# EAGLE design Schematic (EAGLE 8.6.3)
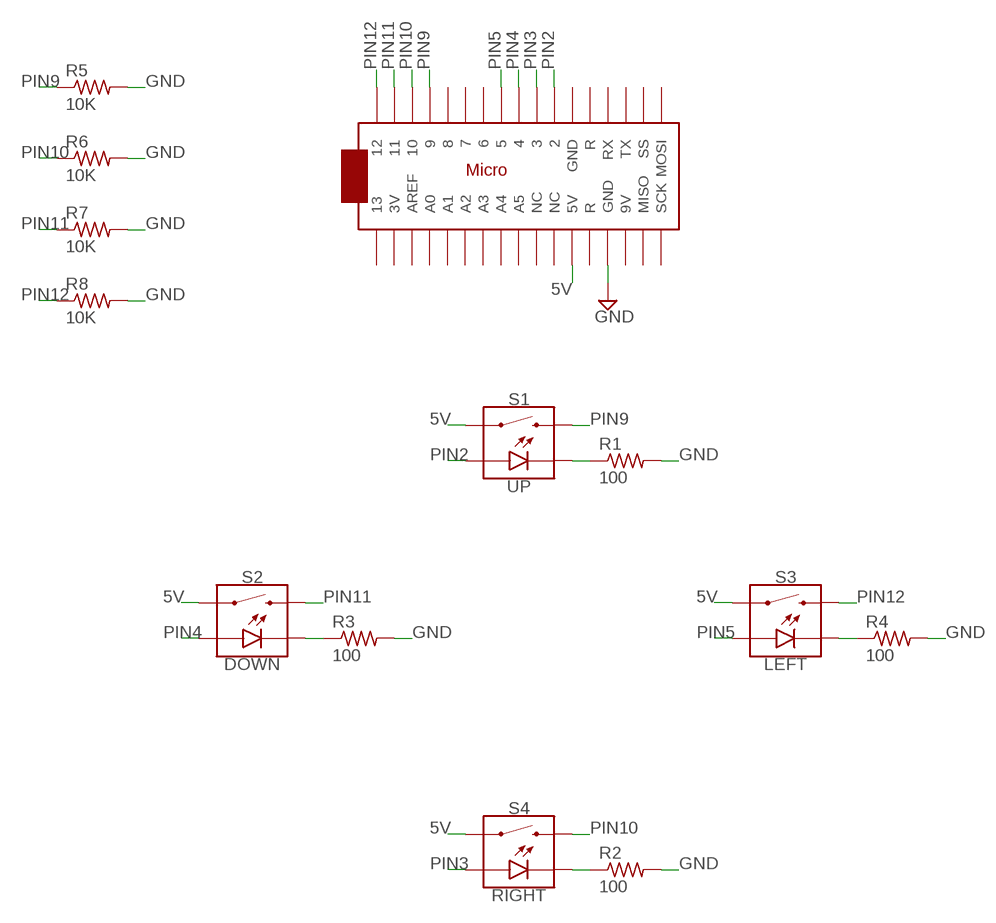
[diagram p0: schematic, sheet 1]

## Parts
R1  100  R-US_0207/7  [0207/7]
R2  100  R-US_0207/7  [0207/7]
R3  100  R-US_0207/7  [0207/7]
R4  100  R-US_0207/7  [0207/7]
R5  10K  R-US_0207/7  [0207/7]
R6  10K  R-US_0207/7  [0207/7]
R7  10K  R-US_0207/7  [0207/7]
R8  10K  R-US_0207/7  [0207/7]
S1  UP  MOMENTARY-SWITCH-SPST-LED-PTH-12MM-KIT  [TACTILE_SWITCH_LED_PTH_12MM_KIT]
S2  DOWN  MOMENTARY-SWITCH-SPST-LED-PTH-12MM-KIT  [TACTILE_SWITCH_LED_PTH_12MM_KIT]
S3  LEFT  MOMENTARY-SWITCH-SPST-LED-PTH-12MM-KIT  [TACTILE_SWITCH_LED_PTH_12MM_KIT]
S4  RIGHT  MOMENTARY-SWITCH-SPST-LED-PTH-12MM-KIT  [TACTILE_SWITCH_LED_PTH_12MM_KIT]
U$1  ARDUINOMICRO  [ARDUINOMICRO]

## Nets
5V: S1.4 S2.4 S3.4 S4.4 U$1.P$23(5V)
GND: R1.2 R2.2 R3.2 R4.2 R5.2 R6.2 R7.2 R8.2 U$1.P$12(GND)
N$5: R1.1 S1.C
N$6: R3.1 S2.C
N$7: R2.1 S4.C
N$8: R4.1 S3.C
PIN2: S1.A U$1.P$11
PIN3: S4.A U$1.P$10
PIN4: S2.A U$1.P$9
PIN5: S3.A U$1.P$8
PIN9: R5.1 S1.2 U$1.P$4
PIN10: R6.1 S4.2 U$1.P$3
PIN11: R7.1 S2.2 U$1.P$2
PIN12: R8.1 S3.2 U$1.P$1
Unconnected: U$1.P$5 U$1.P$6 U$1.P$7 U$1.P$13(R) U$1.P$14(RX) U$1.P$15(TX) U$1.P$16(SS) U$1.P$17(MOSI) U$1.P$18(SCK) U$1.P$19(MISO) U$1.P$20(9V) U$1.P$21(GND) U$1.P$22(R) U$1.P$24(NC) U$1.P$25(NC) U$1.P$26(A5) U$1.P$27(A4) U$1.P$28(A3) U$1.P$29(A2) U$1.P$30(A1) U$1.P$31(A0) U$1.P$32(AREF) U$1.P$33(3V) U$1.P$34

## Library data of the parts
R1-R8 = adafruit:R-US_: RESISTOR, American symbol
S1-S4 = SparkFun-Switches:MOMENTARY-SWITCH-SPST-LED: Momentary Switch (Pushbutton) - SPST - w/ LED Normally-open (NO) SPST momentary switches (buttons, pushbuttons), with a built-in LED. Variants PTH-CHERRY - Cherry MX Switch Cherry MX Keyswitches are top-of-the-line mechanical keyboard switches. They’re satisfyingly “clicky”, reliable up to tens-of-millions of key presses, and a standard in gaming and programming keyboards across the globe. This ‘blue’ version Cherry MX Switch is favored by most due to its secondary internal actuator making it less likely to “double-tap.” If you are looking for a noticeably audible and high-quality key switch, this is the perfect option for you! Cherry MX Switch <https://www.sparkfun.com/products/13834> (COM-13834) Cherry MX Switch Breakout <https://www.sparkfun.com/products/13773> (BOB-13773) PTH-12MM and PTH-12MM-KIT - 12mm Illuminated LED KIT variant is for soldering kits. There is no tStop (covering up the top side of the pads with mask). This helps the beginner see which side they should be soldering too. LED Tactile Button Breakout <https://www.sparkfun.com/products/10467> (BOB-10467) LED Tactile Button - Red <https://www.sparkfun.com/products/10442> (COM-10442) LED Tactile Button - Blue <https://www.sparkfun.com/products/10443> (COM-10443) LED Tactile Button - Green <https://www.sparkfun.com/products/10440> (COM-10440) LED Tactile Button - Orange <https://www.sparkfun.com/products/10441> (COM-10441) LED Tactile Button - White <https://www.sparkfun.com/products/10439> (COM-10439); PROD_ID: SWCH-11758; SF_SKU: COM-10442
U$1 = adafruit:ARDUINOMICRO

## Board
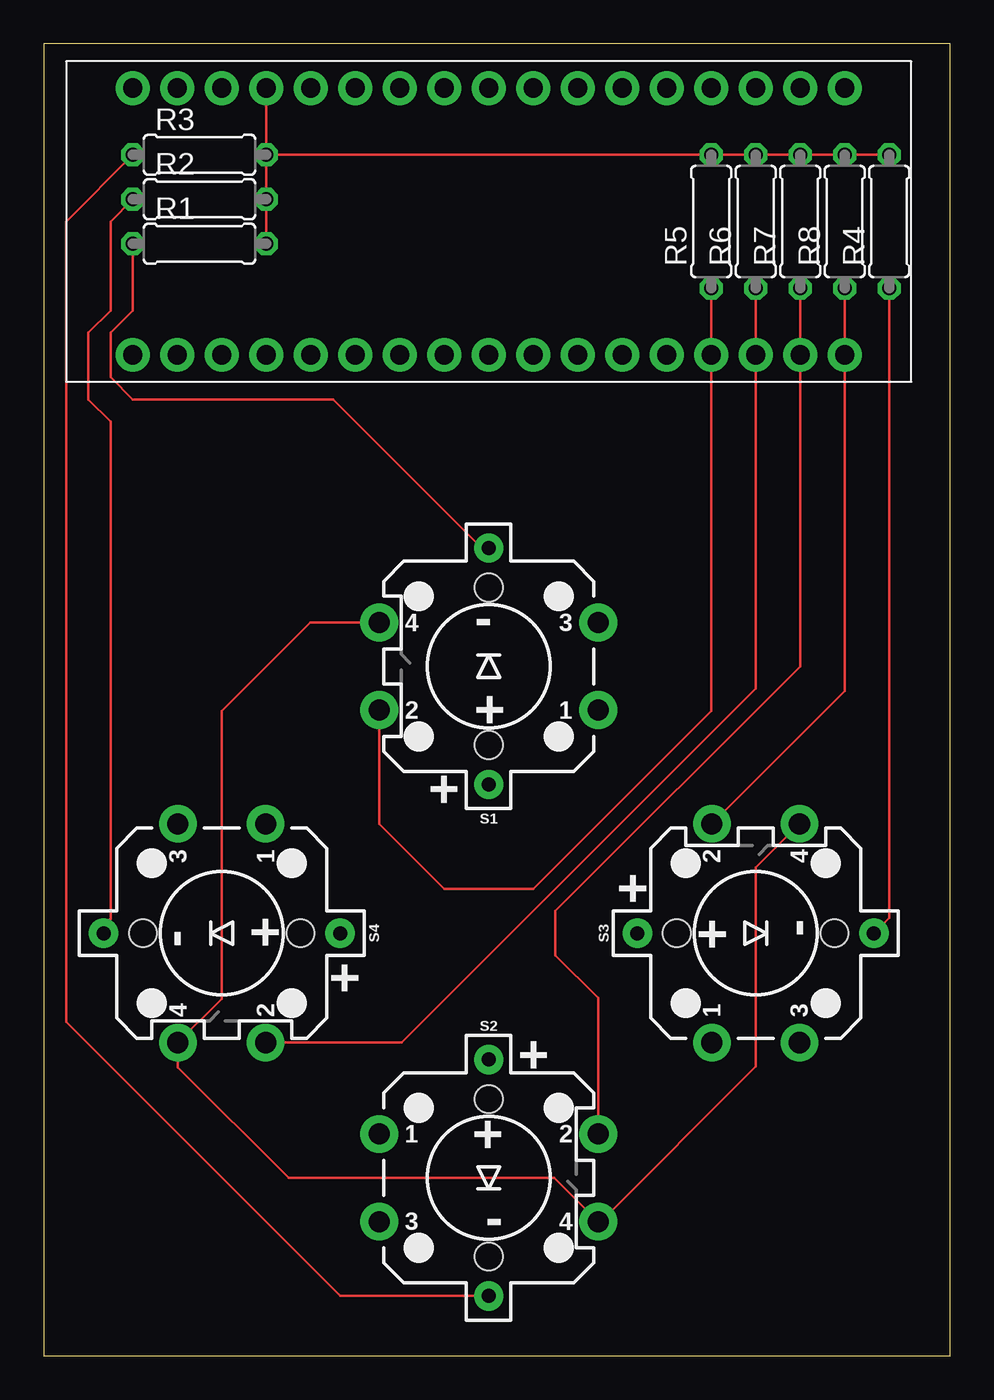
[diagram p1: board, top side]
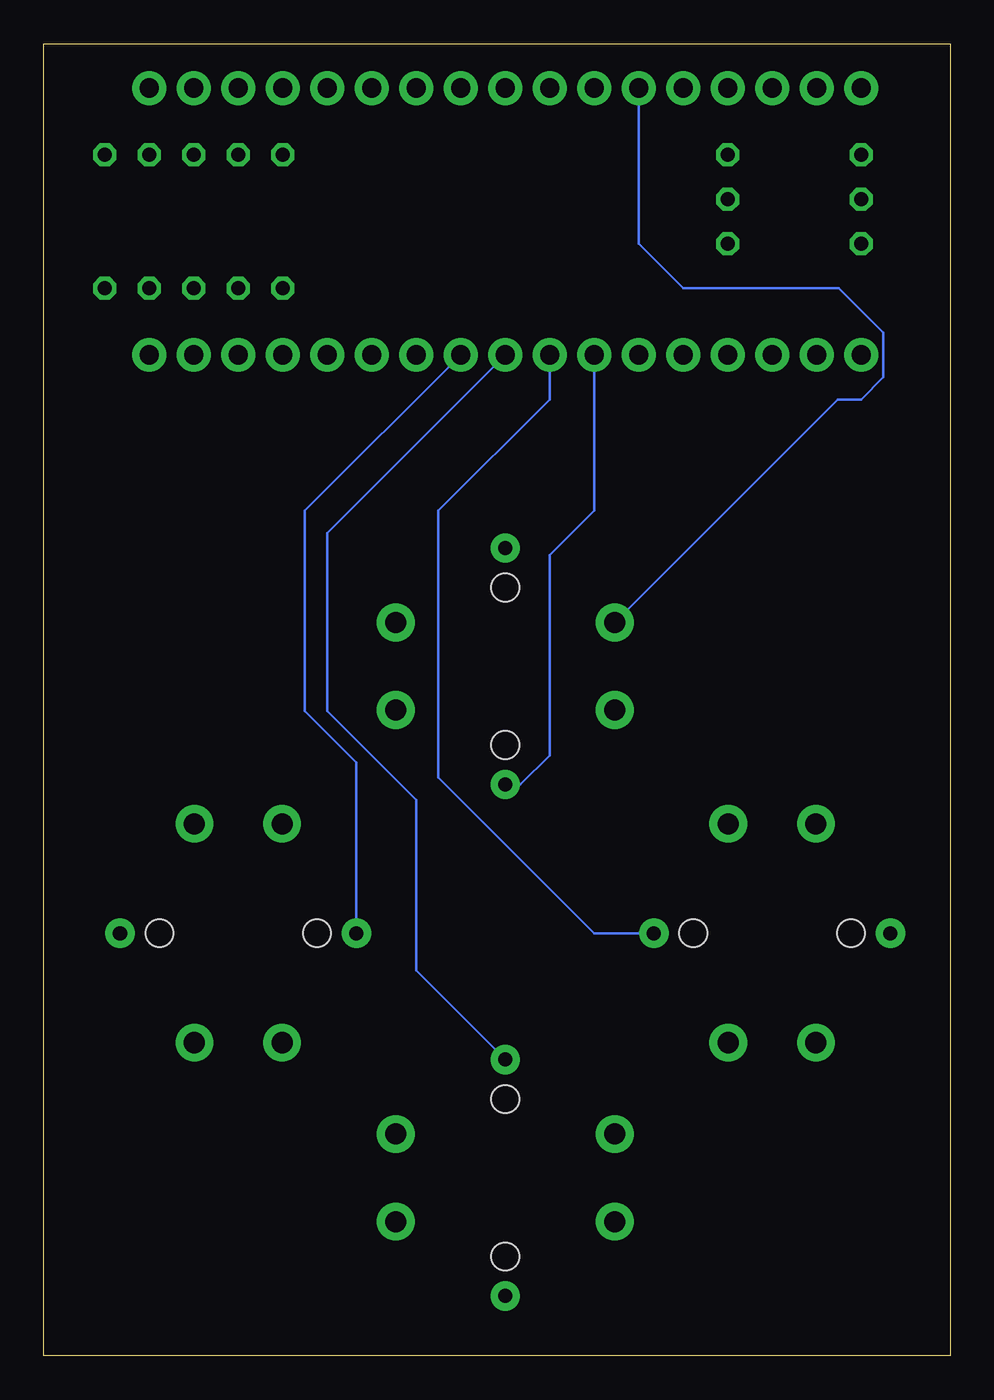
[diagram p2: board, bottom side, seen from below]

Size 51.74 x 74.92 mm. Coordinates in mm from the lower left corner, seen from the top.
Outline: 0,0 51.74,0 51.74,74.92 0,74.92 0,0
Copper layers (1*16): Top 0.035mm / dielectric 1.5mm / Bottom 0.035mm
Design rules "default": minimum track width 6mil, minimum drill 0.35mm, track to track 6mil, track to pad 6mil, pad to pad 6mil, via to via 6mil, smd to smd 6mil, copper to edge 40mil, drill to drill 6mil, minimum pad ring 10mil, minimum via ring 8mil, stop-mask expansion 4mil, vias tented up to drill 0mil, thermal gap 10mil

### Footprints (pad centres in the part's own frame; a part is rotated, then mirrored left to right if it is on the bottom)
0207/7 = drill 0.813 octagon: 1 -3.81,0; 2 3.81,0
TACTILE_SWITCH_LED_PTH_12MM_KIT = drill 1.2 pad 2.159: 1 -6.25,2.5; 2 6.25,2.5; 3 -6.25,-2.5; 4 6.25,-2.5 | drill 0.8 pad 1.676: A 0,6.75; C 0,-6.75 | hole 1.6: 0,4.5; 0,-4.5
ARDUINOMICRO = drill 1.1 pad 1.93: P$1 -20.32,7.62; P$2 -17.78,7.62; P$3 -15.24,7.62; P$4 -12.7,7.62; P$5 -10.16,7.62; P$6 -7.62,7.62; P$7 -5.08,7.62; P$8 -2.54,7.62; P$9 0,7.62; P$10 2.54,7.62; P$11 5.08,7.62; P$12 12.7,-7.62; P$13 10.16,-7.62; P$14 12.7,7.62; P$15 15.24,7.62; P$16 17.78,7.62; P$17 20.32,7.62; P$18 20.32,-7.62; P$19 17.78,-7.62; P$20 15.24,-7.62; P$21 7.62,7.62; P$22 10.16,7.62; P$23 7.62,-7.62; P$24 5.08,-7.62; P$25 2.54,-7.62; P$26 0,-7.62; P$27 -2.54,-7.62; P$28 -5.08,-7.62; P$29 -7.62,-7.62; P$30 -10.16,-7.62; P$31 -12.7,-7.62; P$32 -15.24,-7.62; P$33 -17.78,-7.62; P$34 -20.32,-7.62

### Placement (x,y rotation side)
R1  8.89,63.5 0 top
R2  8.89,66.04 0 top
R3  8.89,68.58 0 top
R4  48.26,64.77 90 top
R5  38.1,64.77 90 top
R6  40.64,64.77 90 top
R7  43.18,64.77 90 top
R8  45.72,64.77 90 top
S1  25.4,39.37 180 top
S2  25.4,10.16 0 top
S3  40.64,24.13 90 top
S4  10.16,24.13 270 top
U$1  25.4,64.77 180 top

### Tracks (layer width: path | path; a pad name or v marks a point on that pad's centre or on a via)
5V
  Top 0.152: S1.4 15.2,41.87 10.16,36.83 10.16,20.38 S4.4 7.66,16.47 13.97,10.16 29.15,10.16 S2.4 31.79,7.66 40.64,16.51 40.64,27.88 S3.4
  Bottom 0.152: S1.4 6.41,54.61 5.08,54.61 3.81,55.88 3.81,58.42 6.35,60.96 15.24,60.96 17.78,63.5 U$1.P$23
GND
  Top 0.152: R1.2 R2.2 R3.2 | R3.2 U$1.P$12 | R3.2 R5.2 R6.2 R7.2 R8.2 R4.2
N$5
  Top 0.152: R1.1 5.08,59.69 3.81,58.42 3.81,55.88 5.08,54.61 16.51,54.61 25,46.12 S1.C
N$6
  Top 0.152: R3.1 1.27,64.77 1.27,19.05 16.91,3.41 S2.C
N$7
  Top 0.152: R2.1 3.81,64.77 3.81,59.69 2.54,58.42 2.54,54.61 3.81,53.34 3.81,24.96 3.77,24.91 3.77,24.49 S4.C
N$8
  Top 0.152: S3.C 48.26,25 R4.1
PIN2
  Bottom 0.152: S1.A 24.53,32.62 22.86,34.29 22.86,45.72 20.32,48.26 U$1.P$11
PIN3
  Bottom 0.152: S4.A 20.32,24.13 29.21,33.02 29.21,48.26 22.86,54.61 U$1.P$10
PIN4
  Bottom 0.152: S2.A 30.48,21.99 30.48,31.75 35.56,36.83 35.56,46.99 U$1.P$9
PIN5
  Bottom 0.152: U$1.P$8 36.83,48.26 36.83,36.83 33.89,33.89 S3.A
PIN9
  Top 0.152: R5.1 U$1.P$4 38.1,36.83 27.94,26.67 22.86,26.67 19.15,30.38 S1.2
PIN10
  Top 0.152: R6.1 U$1.P$3 40.64,38.1 20.42,17.88 S4.2
PIN11
  Top 0.152: R7.1 U$1.P$2 43.18,39.37 29.21,25.4 29.21,22.86 31.65,20.42 S2.2
PIN12
  Top 0.152: R8.1 U$1.P$1 45.72,37.96 S3.2